# Altium schematic sheet CONNECTORS.SchDoc
size A4; DocumentNumber: 1; SheetNumber: 6; SheetTotal: 6
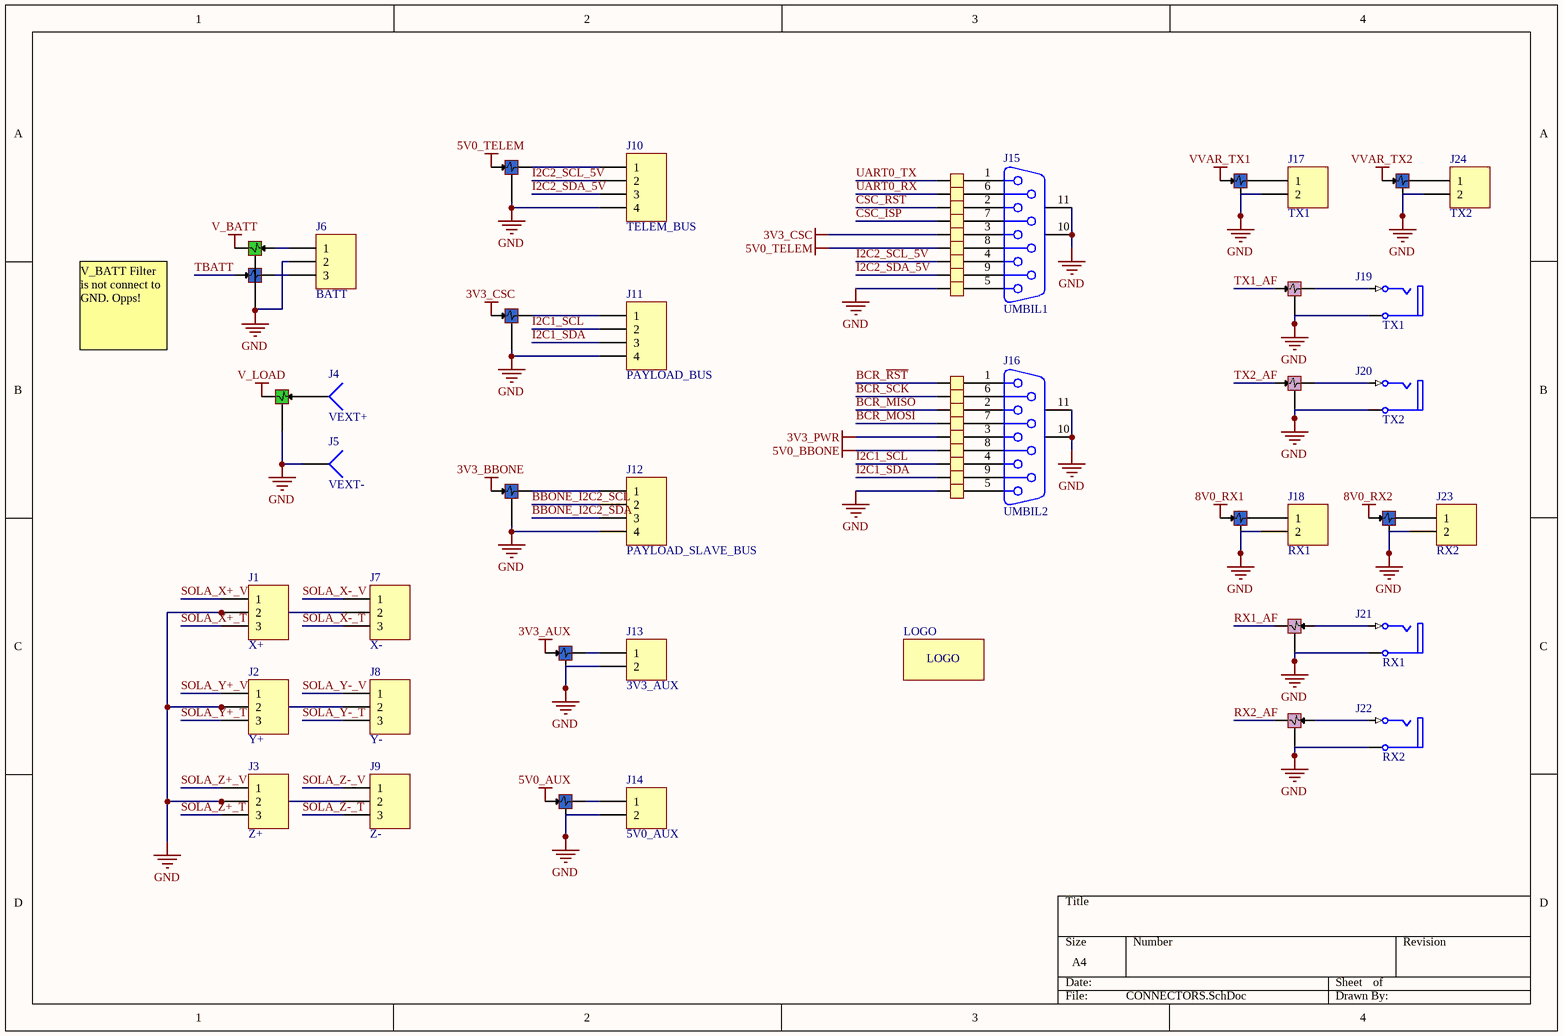
[diagram p0: CONNECTORS.SchDoc]

## Parts
F1  FilterSola  [FILTERSOLA]  (value not drawn)
F2  FilterPwr  [FILTERPWR]  (value not drawn)
F3  FilterPwr  [FILTERPWR]  (value not drawn)
F4  FilterPwr  [FILTERPWR]  (value not drawn)
F5  FilterPwr  [FILTERPWR]  (value not drawn)
F6  FilterPwr  [FILTERPWR]  (value not drawn)
F7  FilterPwr  [FILTERPWR]  (value not drawn)
F8  FilterPwr  [FILTERPWR]  (value not drawn)
F9  Filter  [Filter]  (value not drawn)
F10  Filter  [Filter]  (value not drawn)
F11  Filter  [Filter]  (value not drawn)
F12  Filter  [Filter]  (value not drawn)
F13  FilterPwr  [FILTERPWR]  (value not drawn)
F14  FilterPwr  [FILTERPWR]  (value not drawn)
F98  FilterPwr  [FILTERPWR]  (value not drawn)
F99  FilterSola  [FILTERSOLA]  (value not drawn)
J1  X+  [SCREW3]
J2  Y+  [SCREW3]
J3  Z+  [SCREW3]
J4  VEXT+  [4MM_BANANA]
J5  VEXT-  [4MM_BANANA]
J6  BATT  [SCREW3]
J7  X-  [SCREW3]
J8  Y-  [SCREW3]
J9  Z-  [SCREW3]
J10  TELEM_BUS  [HDR1X4]
J11  PAYLOAD_BUS  [HDR1X4]
J12  PAYLOAD_SLAVE_BUS  [HDR1X4]
J13  3V3_AUX  [SCREW2]
J14  5V0_AUX  [SCREW2]
J15  UMBIL1  [D9 - temp]
J16  UMBIL2  [D9 - temp]
J17  TX1  [SCREW2]
J18  RX1  [SCREW2]
J19  TX1  [R/A RCA]
J20  TX2  [R/A RCA]
J21  RX1  [R/A RCA]
J22  RX2  [R/A RCA]
J23  RX2  [SCREW2]
J24  TX2  [SCREW2]
LOGO  (no value)  [LOGO]
P185  Jumper  [Jumper]  (value not drawn)
P186  Jumper  [Jumper]  (value not drawn)
P187  Jumper  [Jumper]  (value not drawn)
P188  Jumper  [Jumper]  (value not drawn)
P189  Jumper  [Jumper]  (value not drawn)
P190  Jumper  [Jumper]  (value not drawn)
P191  Jumper  [Jumper]  (value not drawn)
P192  Jumper  [Jumper]  (value not drawn)
P193  Jumper  [Jumper]  (value not drawn)
P194  Jumper  [Jumper]  (value not drawn)
P195  Jumper  [Jumper]  (value not drawn)
P196  Jumper  [Jumper]  (value not drawn)
P197  Jumper  [Jumper]  (value not drawn)
P198  Jumper  [Jumper]  (value not drawn)
P199  Jumper  [Jumper]  (value not drawn)
P200  Jumper  [Jumper]  (value not drawn)
P201  Jumper  [Jumper]  (value not drawn)
P202  Jumper  [Jumper]  (value not drawn)

## Nets
3V3_AUX: F5.1
3V3_BBONE: F4.1
3V3_CSC: F3.1 P189.1
3V3_PWR: P198.1
5V0_AUX: F6.1
5V0_BBONE: P199.1
5V0_TELEM: F2.1 P190.1
8V0_RX1: F8.1
8V0_RX2: F13.1
GND: F1.3 F2.3 F3.3 F4.3 F5.3 F6.3 F7.3 F8.3 F9.3 F10.3 F11.3 F12.3 F13.3 F14.3 F98.3 J1.2 J2.2 J3.2 J5.1 J6.2 J7.2 J8.2 J9.2 J10.4 J11.4 J12.4 J13.2 J14.2 J15.10(MH1) J15.11(MH2) J16.10(MH1) J16.11(MH2) J17.2 J18.2 J19.1A(Ground) J20.1A(Ground) J21.1A(Ground) J22.1A(Ground) J23.2 J24.2 P193.1 P202.1
V_BATT: F99.2
V_LOAD: F1.2
VVAR_TX1: F7.1
VVAR_TX2: F14.1
BBONE_I2C2_SCL: J12.2
BBONE_I2C2_SDA: J12.3
BCR_MISO: P196.1
BCR_MOSI: P197.1
BCR_~{RST}: P194.1
BCR_SCK: P195.1
CSC_ISP: P188.1
CSC_RST: P187.1
I2C1_SCL: J11.2 P200.1
I2C1_SDA: J11.3 P201.1
I2C2_SCL_5V: J10.2 P191.1
I2C2_SDA_5V: J10.3 P192.1
RX1_AF: F11.2
RX2_AF: F12.2
SOLA_X+_T: J1.3
SOLA_X+_V: J1.1
SOLA_X-_T: J7.3
SOLA_X-_V: J7.1
SOLA_Y+_T: J2.3
SOLA_Y+_V: J2.1
SOLA_Y-_T: J8.3
SOLA_Y-_V: J8.1
SOLA_Z+_T: J3.3
SOLA_Z+_V: J3.1
SOLA_Z-_T: J9.3
SOLA_Z-_V: J9.1
TBATT: F98.1
TX1_AF: F9.1
TX2_AF: F10.1
UART0_RX: P186.1
UART0_TX: P185.1
NetF1_1: F1.1 J4.1
NetF2_2: F2.2 J10.1
NetF3_2: F3.2 J11.1
NetF4_2: F4.2 J12.1
NetF5_2: F5.2 J13.1
NetF6_2: F6.2 J14.1
NetF7_2: F7.2 J17.1
NetF8_2: F8.2 J18.1
NetF9_2: F9.2 J19.2B(Signal)
NetF10_2: F10.2 J20.2B(Signal)
NetF11_1: F11.1 J21.2B(Signal)
NetF12_1: F12.1 J22.2B(Signal)
NetF13_2: F13.2 J23.1
NetF14_2: F14.2 J24.1
NetF98_2: F98.2 J6.3
NetF99_1: F99.1 J6.1
NetJ15_1: J15.1 P185.2
NetJ15_2: J15.2 P187.2
NetJ15_3: J15.3 P189.2
NetJ15_4: J15.4 P191.2
NetJ15_5: J15.5 P193.2
NetJ15_6: J15.6 P186.2
NetJ15_7: J15.7 P188.2
NetJ15_8: J15.8 P190.2
NetJ15_9: J15.9 P192.2
NetJ16_1: J16.1 P194.2
NetJ16_2: J16.2 P196.2
NetJ16_3: J16.3 P198.2
NetJ16_4: J16.4 P200.2
NetJ16_5: J16.5 P202.2
NetJ16_6: J16.6 P195.2
NetJ16_7: J16.7 P197.2
NetJ16_8: J16.8 P199.2
NetJ16_9: J16.9 P201.2

Not connected (* = marked no-connect by the designer): F99 3

## Notes on the sheet
- V_BATT Filter is not connect to GND. Opps!

## Library data of the parts
J1-J3 J6-J9 = Header 3: Header, 3-Pin; LatestRevisionDate: 17-Jul-2002; LatestRevisionNote: Re-released for DXP Platform.; Publisher: Altium Limited
J4 J5 = Socket: LatestRevisionDate: 17-Jul-2002; LatestRevisionNote: Re-released for DXP Platform.; Publisher: Altium Limited
J10-J12 = Header 4: Header, 4-Pin; LatestRevisionDate: 17-Jul-2002; LatestRevisionNote: Re-released for DXP Platform.; Publisher: Altium Limited
J13 J14 J17 J18 J23 J24 = Header 2: Header, 2-Pin; LatestRevisionDate: 17-Jul-2002; LatestRevisionNote: Re-released for DXP Platform.; Publisher: Altium Limited
J15 J16 = D Connector 9: Receptacle Assembly, 9 Position, Right Angle; PackageDocument: O; Positions: 9; Published: 15-Jun-2001; LatestRevisionDate: 17-Jul-2002; LatestRevisionNote: Re-released for DXP Platform.; DatasheetDocument: 1-Sep-1999; PackageReference: 788750; Publisher: Altium Limited; Orientation: Right Angle; Gender: Receptacle
J19-J22 = RCA: RCA Phono Jack, Right Angle, Thru-Hole, Snap-In; pin to pad: 1A>1 2B>2; PCB_Layout: Complies with manufacturer's recommendation.; DrillAndSlotSize: Corresponds to nominal value.; Published: 15-Jul-2004; LatestRevisionDate: 15-Jul-2004; LatestRevisionNote: Component Replaced.; DatasheetDocument: 7-Jul-2000; PackageDocument: 7-Jul-2000; PackageReference: 161; Publisher: Altium Limited; ComponentLink1Description: Manufacturer Link; ComponentLink1URL: http://www.mouser.com/kobiconn/
LOGO = LOGO